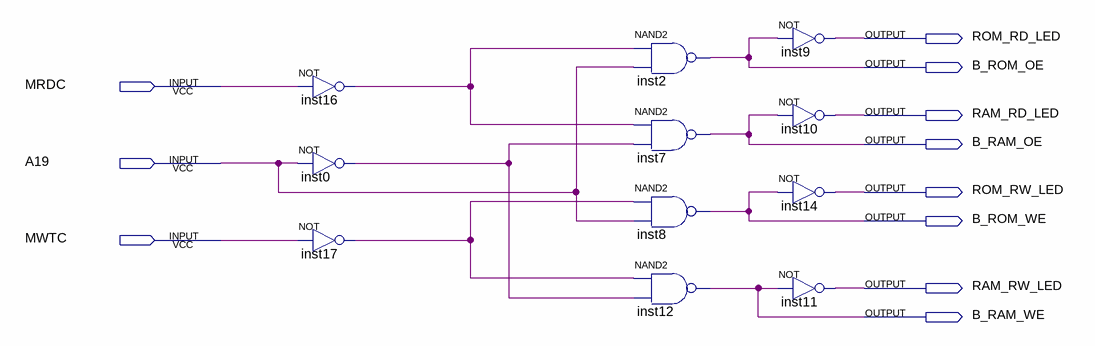
[diagram p0: schematic sheet]
// Quartus schematic Ram-Rom_Logic.bdf as structural Verilog: 11 symbols, 11 pins
module \Ram-Rom_Logic  (
  input  MRDC,
  input  A19,
  input  MWTC,
  output ROM_RD_LED,
  output B_ROM_OE,
  output RAM_RD_LED,
  output B_RAM_OE,
  output ROM_RW_LED,
  output B_ROM_WE,
  output RAM_RW_LED,
  output B_RAM_WE
);

  wire inst0_out, inst16_out, inst17_out;

  not inst16 (inst16_out, MRDC);
  not inst0 (inst0_out, A19);
  not inst17 (inst17_out, MWTC);
  nand inst2 (B_ROM_OE, inst16_out, A19);
  nand inst7 (B_RAM_OE, inst16_out, inst0_out);
  nand inst8 (B_ROM_WE, inst17_out, A19);
  nand inst12 (B_RAM_WE, inst17_out, inst0_out);
  not inst9 (ROM_RD_LED, B_ROM_OE);
  not inst10 (RAM_RD_LED, B_RAM_OE);
  not inst14 (ROM_RW_LED, B_ROM_WE);
  not inst11 (RAM_RW_LED, B_RAM_WE);
endmodule
